# EasyEDA Pro project USB hub.eprj

# Schematic Schematic1
Board Name: Board1; Create Date: 2026-04-03; Page Name: P1; Project Name: USB hub; Schematic Name: Schematic1; Update Date: 2026-04-03; Company: EasyEDA.com; Page Size: A4; Version: V1.0
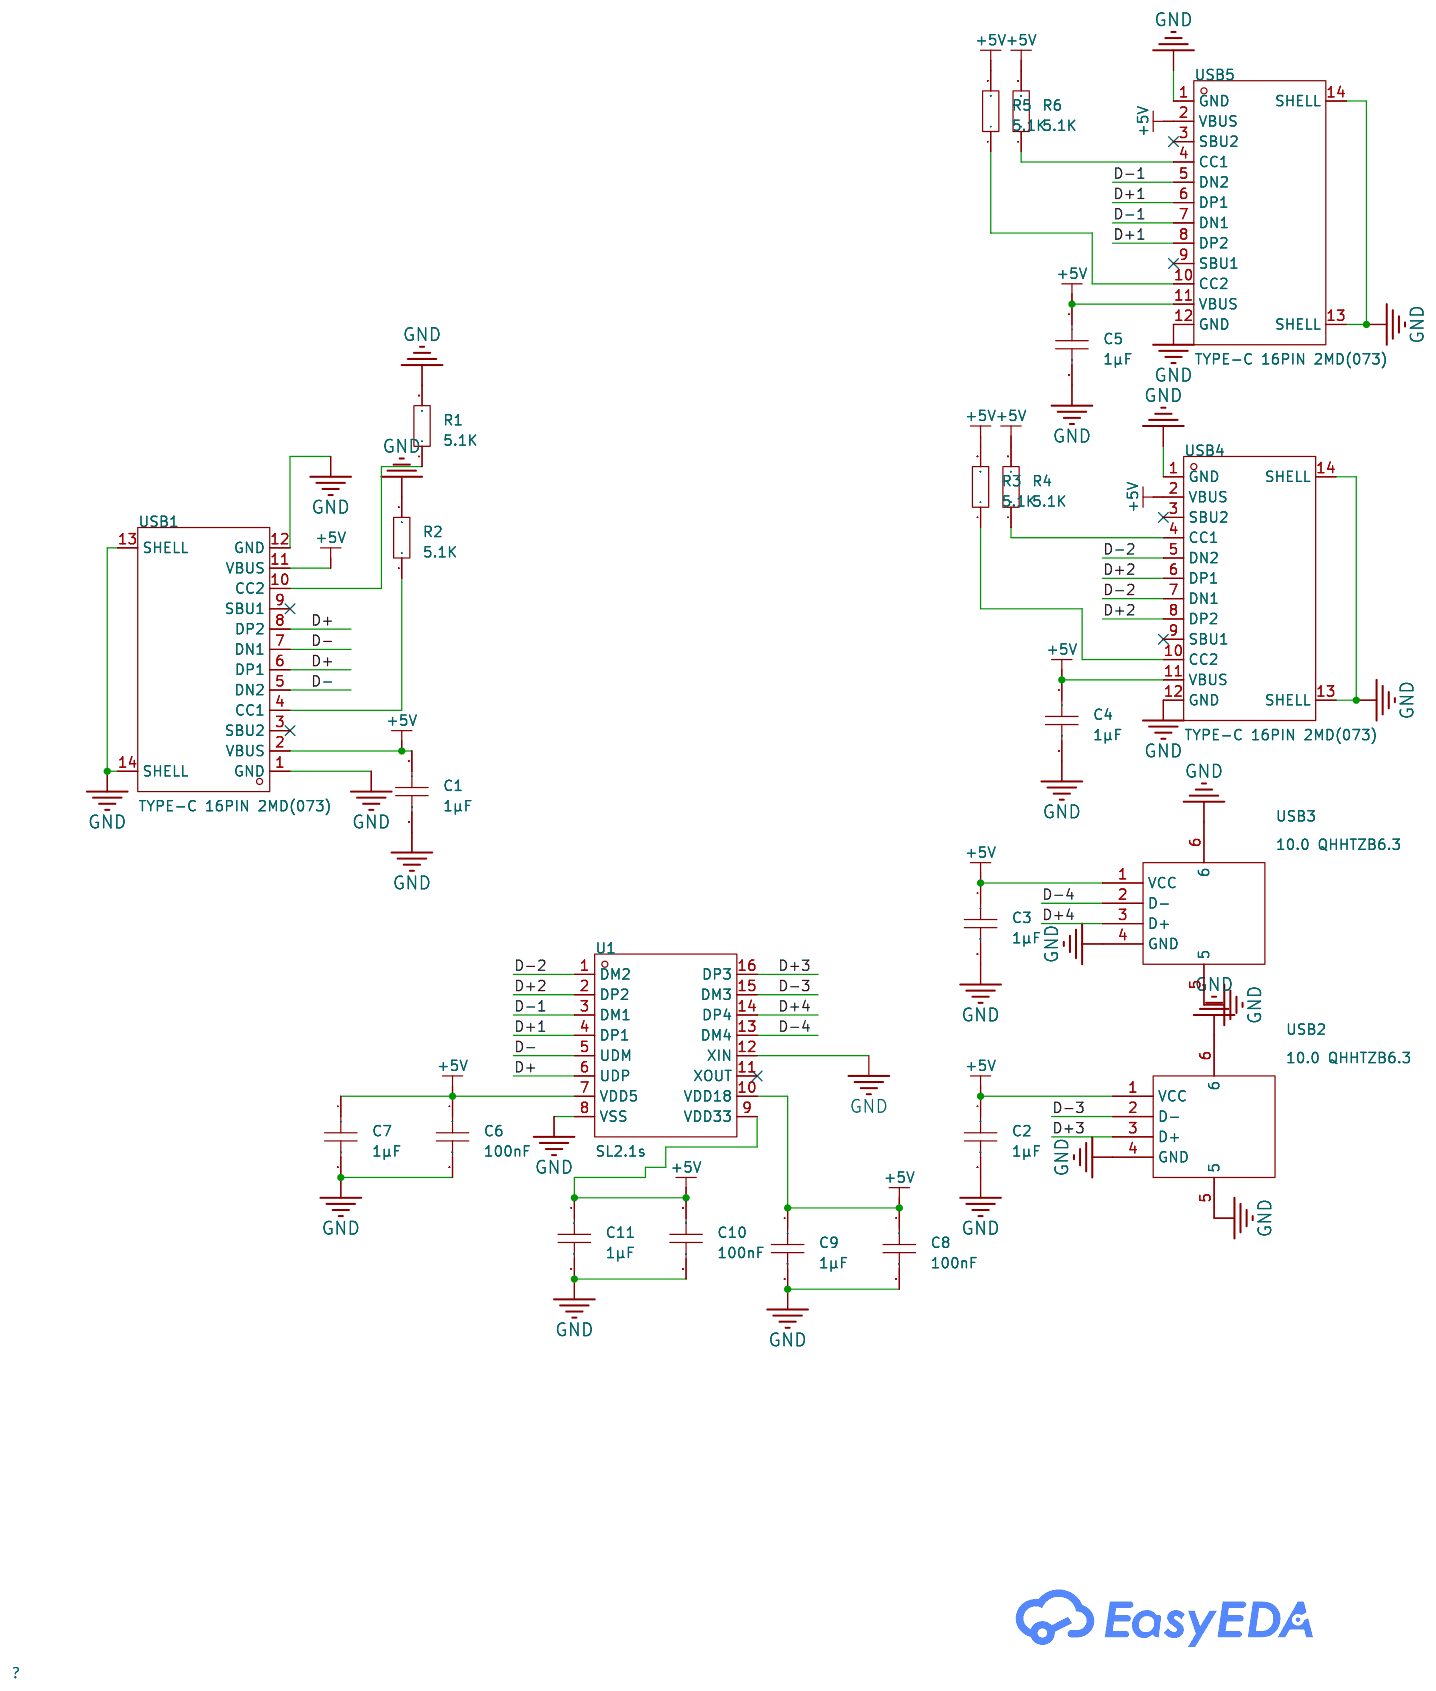
[diagram p0: schematic sheet]

## Parts
C1  1µF  [C0603]
C2  1µF  [C0603]
C3  1µF  [C0603]
C4  1µF  [C0603]
C5  1µF  [C0603]
C6  100nF  [C0603]
C7  1µF  [C0603]
C8  100nF  [C0603]
C9  1µF  [C0603]
C10  100nF  [C0603]
C11  1µF  [C0603]
R1  5.1K  [R0603]
R2  5.1K  [R0603]
R3  5.1K  [R0603]
R4  5.1K  [R0603]
R5  5.1K  [R0603]
R6  5.1K  [R0603]
U1  SL2.1s  [SSOP-16_L4.6-W2.6-P0.53-LS4.0-BL]
USB1  TYPE-C 16PIN 2MD(073)  [USB-C-SMD_TYPE-C-6PIN-2MD-073]
USB2  10.0 QHHTZB6.3  [USB-A-TH_10.0QHHTZB6.3]
USB3  10.0 QHHTZB6.3  [USB-A-TH_10.0QHHTZB6.3]
USB4  TYPE-C 16PIN 2MD(073)  [USB-C-SMD_TYPE-C-6PIN-2MD-073]
USB5  TYPE-C 16PIN 2MD(073)  [USB-C-SMD_TYPE-C-6PIN-2MD-073]

## Library data of the parts
C1-C11 = CAP_0603: Supplier Footprint: 0603
R1-R6 = Res_0603: Supplier Footprint: 0603
U1 = SL2.1s: LCSC Part Name: USB2.0 HUB控制器集成电路; Supplier Part: C2684433; Manufacturer: CoreChips(和芯润德); Supplier Footprint: SSOP-16; JLCPCB Part Class: Extended Part; Datasheet: https://item.szlcsc.com/datasheet/SL2.1s/2782346.html; Supplier: LCSC; type: Hub; USB Protocol: USB 2.0; Voltage - Supply: 4V~5.25V; Operating Temperature: 0℃~+70℃; Current - Supply: 120mA; Quiescent Supply Current: 2.5mA; Number of Channels: 4
USB1 USB4 USB5 = TYPE-C 16PIN 2MD(073): LCSC Part Name: Type-C 母 卧贴; Supplier Part: C2765186; Manufacturer: SHOU HAN(首韩); Supplier Footprint: SMD; JLCPCB Part Class: Extended Part; Datasheet: https://item.szlcsc.com/datasheet/TYPE-C%252016PIN%25202MD(073)/2901843.html; Supplier: LCSC; Connector Type: Type-C; Gender: Female; Mounting Type: Surface Mount, Right Angle; Number of Contacts: 16P; Number of Ports: 1; Current Rating-Power: 3A; Voltage Rating: 5V; Connect-Disconnect Life: 10,000 Cycles; Detection color: Black; Operating Temperature: -25℃~+85℃
USB2 USB3 = 10.0 QHHTZB6.3: LCSC Part Name: 壳长10.0mm; Supplier Part: C668591; Manufacturer: SHOU HAN(首韩); Supplier Footprint: SMD; JLCPCB Part Class: Extended Part; Datasheet: https://item.szlcsc.com/datasheet/10.0%2520QHHTZB6.3/698534.html; Supplier: LCSC; Connector Type: Type-A; Protocol Standard: USB 2.0; Gender: Female; Mounting Type: Surface Mount, Right Angle; Number of Contacts: 4P; Number of Ports: 1; Current Rating-Power: 1.5A; Voltage Rating: 30V; Connect-Disconnect Life: 5,000 times; Length: 10mm; Detection color: Black; Operating Temperature: -25℃~+85℃

## Nets
+5V: C1.1 C2.1 C3.1 C4.1 C5.1 C6.1 C7.1 C8.1 C9.1 C10.1 C11.1 R3.2 R4.2 R5.2 R6.2 U1.7(VDD5) U1.9(VDD33) U1.10(VDD18) USB1.2(VBUS) USB1.11(VBUS) USB2.1(VCC) USB3.1(VCC) USB4.2(VBUS) USB4.11(VBUS) USB5.2(VBUS) USB5.11(VBUS)
GND: C1.2 C2.2 C3.2 C4.2 C5.2 C6.2 C7.2 C8.2 C9.2 C10.2 C11.2 R1.2 R2.2 U1.8(VSS) U1.12(XIN) USB1.1(GND) USB1.12(GND) USB1.13(SHELL) USB1.14(SHELL) USB2.4(GND) USB2.5 USB2.6 USB3.4(GND) USB3.5 USB3.6 USB4.1(GND) USB4.12(GND) USB4.13(SHELL) USB4.14(SHELL) USB5.1(GND) USB5.12(GND) USB5.13(SHELL) USB5.14(SHELL)
D+: U1.6(UDP) USB1.6(DP1) USB1.8(DP2)
D+1: U1.4(DP1) USB5.6(DP1) USB5.8(DP2)
D+2: U1.2(DP2) USB4.6(DP1) USB4.8(DP2)
D+3: U1.16(DP3) USB2.3(D+)
D+4: U1.14(DP4) USB3.3(D+)
D-: U1.5(UDM) USB1.5(DN2) USB1.7(DN1)
D-1: U1.3(DM1) USB5.5(DN2) USB5.7(DN1)
D-2: U1.1(DM2) USB4.5(DN2) USB4.7(DN1)
D-3: U1.15(DM3) USB2.2(D-)
D-4: U1.13(DM4) USB3.2(D-)
$1N1717: R3.1 USB4.10(CC2)
$1N1727: R4.1 USB4.4(CC1)
$1N2183: R5.1 USB5.10(CC2)
$1N2188: R6.1 USB5.4(CC1)
Net-(R1-1): R1.1 USB1.10(CC2)
Net-(R2-1): R2.1 USB1.4(CC1)

Not connected (* = marked no-connect by the designer): U1 11(XOUT)*; USB1 3(SBU2)* 9(SBU1)*; USB4 3(SBU2)* 9(SBU1)*; USB5 3(SBU2)* 9(SBU1)*

# Board PCB2
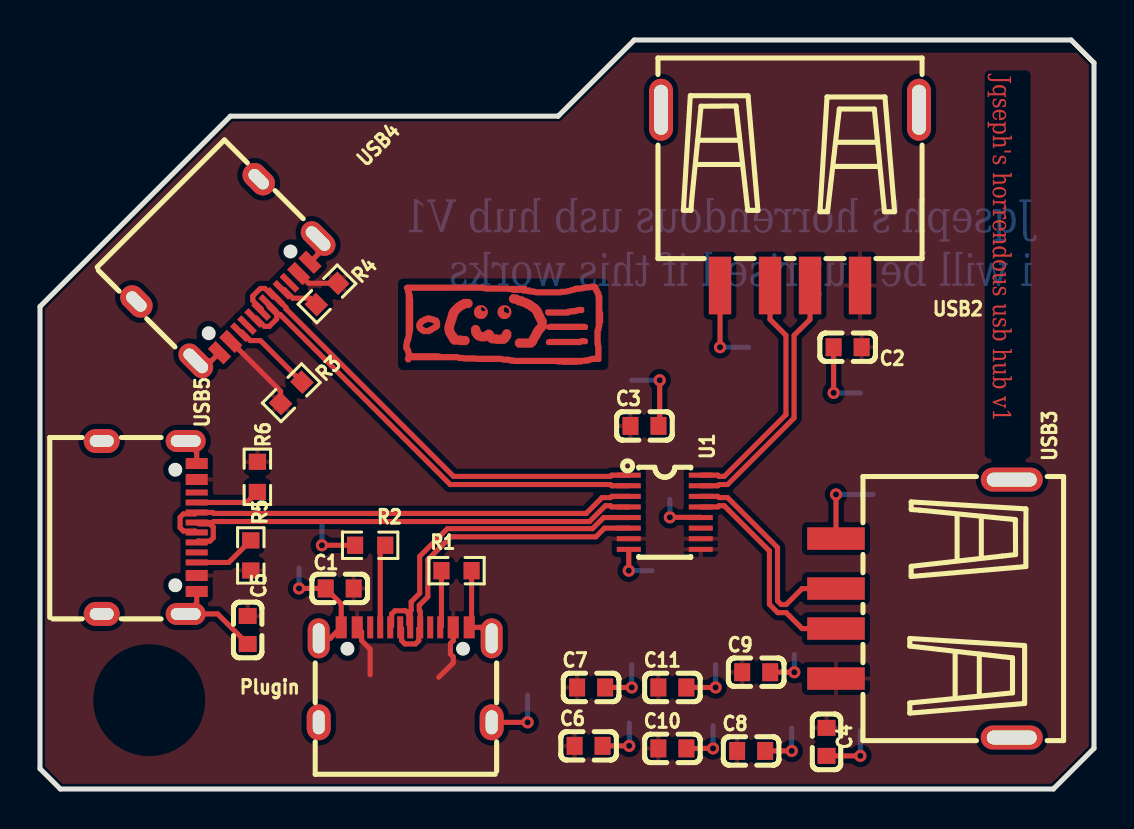
[diagram p1: board, top side]
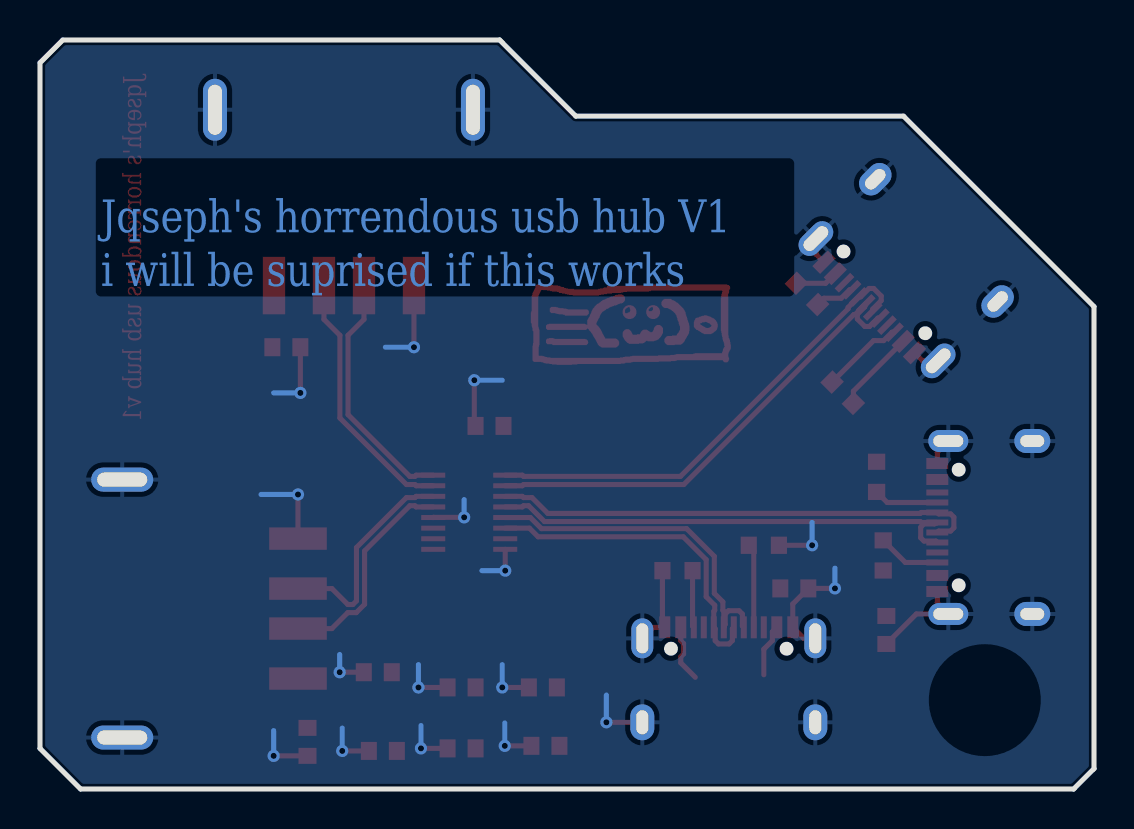
[diagram p2: board, bottom side, seen from below]

Outline 52.71 x 37.47 mm; copper layers: Top Layer, Bottom Layer. Coordinates in mm from the lower left corner of the outline.
Outline path: 0,24.13 0,1.02 1.02,0 50.67,0 52.71,2.03 52.71,36.32 51.56,37.47 29.72,37.47 25.91,33.66 9.53,33.66 0,24.13
Stack: Top Layer 0.035mm / Dielectric1 1.51mm FR4 er 4.5 / Bottom Layer 0.035mm

## Design rules (mm)
net D-2: DP3
net D+2: DP3
net D-1: DP4
net D+1: DP4
net D-: DP5
net D+: DP5
net D-4: DP2
net D+4: DP2
net D-3: DP1
net D+3: DP1
template: JLCPCB Capability(Two Layers Board)
spacing copperThickness1oz (default): track to track 0.102, other pairs 0.152 to 0.3
spacing copperThickness2oz: track to track 0.203, other pairs 0.152 to 0.3
track width copperThickness1oz (default): min 0.127, default 0.254, max 2.54
track width copperThickness2oz: min 0.203, default 0.254, max 2.54
differential pair differentialPair (default): width min 0.127, default 0.254, max 2.54; gap min 0.152, default 0.152
via viaSize (default): diameter min 0.5, default 0.61, max 10; hole min 0.3, default 0.305, max 6.3

## Placement (name value [footprint] x y rotation side)
C1  1µF  [C0603]  14.99 10.03 180 top
C2  1µF  [C0603]  40.39 22.1 180 top
C3  1µF  [C0603]  30.23 18.16 0 top
C4  1µF  [C0603]  39.33 2.36 270 top
C5  1µF  [C0603]  10.38 7.96 270 top
C6  100nF  [C0603]  27.43 2.16 0 top
C7  1µF  [C0603]  27.56 5.08 0 top
C8  100nF  [C0603]  35.56 1.91 0 top
C9  1µF  [C0603]  35.81 5.84 0 top
C10  100nF  [C0603]  31.62 2.03 0 top
C11  1µF  [C0603]  31.62 5.08 0 top
Plugin  TYPE-C 16PIN 2MD(073)  [USB-C-SMD_TYPE-C-6PIN-2MD-073]  18.26 5.71 0 top
R1  5.1K  [R0603]  20.83 10.92 0 top
R2  5.1K  [R0603]  16.51 12.19 180 top
R3  5.1K  [R0603]  12.56 19.82 225 top
R4  5.1K  [R0603]  14.35 24.77 45 top
R5  5.1K  [R0603]  10.54 11.68 270 top
R6  5.1K  [R0603]  10.87 15.61 90 top
U1  SL2.1s  [SSOP-16_L4.6-W2.6-P0.53-LS4.0-BL]  31.24 13.84 270 top
USB2  10.0 QHHTZB6.3  [USB-A-TH_10.0QHHTZB6.3]  37.5 29.58 180 top
USB3  10.0 QHHTZB6.3  [USB-A-TH_10.0QHHTZB6.3]  44.2 9.02 90 top
USB4  TYPE-C 16PIN 2MD(073)  [USB-C-SMD_TYPE-C-6PIN-2MD-073#2]  9.56 25.77 225 top
USB5  TYPE-C 16PIN 2MD(073)  [USB-C-SMD_TYPE-C-6PIN-2MD-073]  5.46 13.08 270 top

## Footprints (pads in the part's own frame, mm; a bottom-side part is the same pattern mirrored in y, then rotated)
C0603
  rect 0.8x0.9 smd: 1(-0.7,0) 2(0.7,0)
R0603
  rect 0.806x0.864 smd: 1(-0.753,0) 2(0.753,0)
SSOP-16_L4.6-W2.6-P0.53-LS4.0-BL
  rect 0.25x1.2 smd: 1(-1.855,-1.8) 2(-1.325,-1.8) 3(-0.795,-1.8) 4(-0.265,-1.8) 5(0.265,-1.8) 6(0.795,-1.8) 7(1.325,-1.8) 8(1.855,-1.8) 9(1.855,1.8) 10(1.325,1.8) 11(0.795,1.8) 12(0.265,1.8) 13(-0.265,1.8) 14(-0.795,1.8) 15(-1.325,1.8) 16(-1.855,1.8)
USB-A-TH_10.0QHHTZB6.3
  rect 1.12x2.88 smd: 1(-3.5,4.395) 2(-1,4.395) 3(1,4.395) 4(3.5,4.395)
  oval 1.2x3.1 hole 0.7x2.5: 5(-6.45,-4.395) 6(6.45,-4.395)
USB-C-SMD_TYPE-C-6PIN-2MD-073
  rect 0.55x1.1 smd: 1(-3.2,2.375) 2(-2.4,2.375) 11(2.4,2.375) 12(3.2,2.375)
  rect 0.3x1.1 smd: 3(-1.75,2.375) 4(-1.25,2.375) 5(-0.75,2.375) 6(-0.25,2.375) 7(0.25,2.375) 8(0.75,2.375) 9(1.25,2.375) 10(1.75,2.375)
  oval 1.1x2 hole 0.6x1.5: 13(-4.325,1.825) 14(4.325,1.825)
  oval 1.2x1.8 hole 0.6x1.2: 13(-4.325,-2.375) 14(4.325,-2.375)
USB-C-SMD_TYPE-C-6PIN-2MD-073#2
  rect 0.55x1.1 smd: 1(-3.2,2.375) 2(-2.4,2.375) 11(2.4,2.375) 12(3.2,2.375)
  rect 0.3x1.1 smd: 3(-1.75,2.375) 4(-1.25,2.375) 5(-0.75,2.375) 6(-0.25,2.375) 7(0.25,2.375) 8(0.75,2.375) 9(1.25,2.375) 10(1.75,2.375)
  oval 1.1x2 hole 0.6x1.5: 13(-4.325,1.825) 14(4.325,1.825)
  oval 1.2x1.8 hole 0.6x1.2: 13(-4.325,-2.375) 14(4.325,-2.375)

## Nets
+5V: C1.1 C2.1 C3.1 C4.1 C5.1 C6.1 C7.1 C8.1 C9.1 C10.1 C11.1 Plugin.2 Plugin.11 R3.2 R4.2 R5.2 R6.2 U1.7 U1.9 U1.10 USB2.1 USB3.1 USB4.2 USB4.11 USB5.2 USB5.11
GND: C1.2 C2.2 C3.2 C4.2 C5.2 C6.2 C7.2 C8.2 C9.2 C10.2 C11.2 Plugin.1 Plugin.12 Plugin.13 Plugin.14 R1.2 R2.2 U1.8 U1.12 USB2.4 USB2.5 USB2.6 USB3.4 USB3.5 USB3.6 USB4.1 USB4.12 USB4.13 USB4.14 USB5.1 USB5.12 USB5.13 USB5.14
D+: Plugin.6 Plugin.8 U1.6
D+1: U1.4 USB5.6 USB5.8
D+2: U1.2 USB4.6 USB4.8
D+3: U1.16 USB2.3
D+4: U1.14 USB3.3
D-: Plugin.5 Plugin.7 U1.5
D-1: U1.3 USB5.5 USB5.7
D-2: U1.1 USB4.5 USB4.7
D-3: U1.15 USB2.2
D-4: U1.13 USB3.2
$1N1095: Plugin.10 R1.1
$1N1104: Plugin.4 R2.1
$1N1717: R3.1 USB4.10
$1N1727: R4.1 USB4.4
$1N2183: R5.1 USB5.10
$1N2188: R6.1 USB5.4

Pads without a net: Plugin 3 9; U1 11; USB4 3 9; USB5 3 9

## Via types
v1: diameter 0.61, hole 0.305, Top Layer to Bottom Layer, 16 vias

## Routing (per net, layer and track width the routed paths; a pad name or vN(x,y) marks a point on that pad's centre or on a via; arc(x,y) is an arc through that point)
+5V: length 11.8
  Top Layer w0.254: USB4.2 13.42,25.3 R4.2 ; 19.94,5.59 20.66,6.31 20.66,6.62 20.52,6.76 20.52,7.28 20.66,7.42 Plugin.11 ; Plugin.2 16.08,7.87 16.08,7.42 16.51,7 16.51,5.72 ; 9.54,22.39 12.03,19.9 12.03,19.29
GND: length 63.4
  Top Layer w0.254: Plugin.14 22.04,8.09 Plugin.12 21.58,8.21 R1.2 ; C10.2 v1(33.66,2.03) ; Plugin.14 v1(24.38,3.34) ; USB4.12 8.57,21.42 7.79,21.42 ; U1.12 33.03,13.59 v1(31.5,13.59) ; R2.2 v1(14.1,12.19) ; Plugin.13 14.51,7.54 Plugin.1 15.06,9.26 C1.2 v1(12.95,10.03) ; C5.2 8.88,8.76 USB5.14 7.84,9.31 USB5.12 ; USB5.13 7.84,16.86 USB5.1 ; C3.2 30.99,18.22 v1(30.99,20.45) ; 13.5,26.35 13.91,26.75 USB4.13 ; 36.51,5.84 v1(37.72,5.84) ; USB3.4 v1(39.8,14.73) ; USB2.4 v1(34,22.1) ; 29.44,11.99 v1(29.44,10.92) ; C6.2 v1(29.46,2.16) ; C4.2 v1(41.02,1.66) ; C2.2 v1(39.69,19.81) ; C11.2 v1(33.78,5.08) ; C7.2 v1(29.59,5.08) ; C8.2 v1(37.59,1.91)
  Bottom Layer w0.254: v1(24.38,3.34) 24.38,4.7 ; v1(12.95,10.03) 12.95,11.05 ; v1(29.59,5.08) 29.59,6.22 ; v1(41.02,1.66) 41.02,2.92 ; v1(33.78,5.08) 33.78,6.22 ; v1(34,22.1) 35.43,22.1 ; v1(29.44,10.92) 30.61,10.92 ; v1(14.1,12.19) 14.1,13.33 ; v1(39.8,14.73) 41.66,14.73 ; v1(37.59,1.91) 37.59,3.05 ; v1(29.46,2.16) 29.46,3.3 ; v1(33.66,2.03) 33.66,3.17 ; v1(37.72,5.84) 37.72,6.73 ; v1(31.5,13.59) 31.5,14.48 ; v1(39.69,19.81) 41.02,19.81 ; v1(30.99,20.45) 29.59,20.45
D+: length 16.7
  Top Layer w0.254: Plugin.6 18.08,8.02 18.08,7.42 18.25,7.26 18.78,7.26 18.94,7.42 18.94,8.02 Plugin.8 19.01,8.89 18.97,8.94 18.97,9.19 19.39,9.62 19.39,11.47 20.54,12.62 27.8,12.62 28.23,13.05 29.44,13.05
D+1: length 24.4
  Top Layer w0.254: 29.44,14.11 28.59,14.11 28.53,14.17 28.27,14.17 27.48,13.38 8.69,13.38 8.64,13.33 USB5.6 7.86,13.31 7.93,13.31 7.98,13.26 8.5,13.26 8.66,13.1 8.66,12.57 8.5,12.4 7.91,12.4 USB5.8
D+2: length 24.2
  Top Layer w0.254: 29.44,15.17 28.59,15.17 28.53,15.23 20.51,15.23 12.01,23.73 11.94,23.73 USB4.6 11.41,24.23 11.47,24.18 11.47,24.11 11.84,23.74 11.84,23.51 11.46,23.13 11.23,23.13 10.81,23.55 USB4.8
D+3: length 12.4
  Top Layer w0.254: USB2.3 36.5,23.49 37.3,22.69 37.3,18.73 34.21,15.64 33.96,15.64 33.9,15.7 U1.16
D+4: length 10.9
  Top Layer w0.254: USB3.3 38.11,10.02 37.31,9.23 37.06,9.23 36.88,9.41 36.88,12.08 34.38,14.58 33.96,14.58 33.9,14.64 U1.14
D-: length 17.4
  Top Layer w0.254: 29.44,13.58 28.18,13.58 27.63,13.02 20.37,13.02 18.99,11.64 18.99,9.79 18.56,9.36 18.56,8.94 18.51,8.89 Plugin.7 18.49,8.11 18.49,8.18 18.44,8.23 18.44,8.75 18.28,8.92 17.75,8.92 17.58,8.75 17.58,8.16 Plugin.5
D-1: length 24.4
  Top Layer w0.254: USB5.7 7.76,12.9 7.17,12.9 7.01,13.07 7.01,13.6 7.17,13.76 7.76,13.76 USB5.5 8.64,13.83 8.69,13.78 27.31,13.78 28.1,14.58 28.53,14.58 28.59,14.64 29.44,14.64
D-2: length 23.8
  Top Layer w0.254: USB4.7 11.06,24.01 10.64,24.43 10.64,24.66 11.02,25.04 11.25,25.04 11.67,24.62 11.77,24.62 12.3,24.09 12.3,24.02 20.68,15.64 28.53,15.64 28.59,15.7 29.44,15.7
D-3: length 13
  Top Layer w0.254: 33.04,15.17 33.9,15.17 33.96,15.23 34.38,15.23 37.71,18.56 37.71,22.69 38.5,23.49 USB2.2
D-4: length 10.9
  Top Layer w0.254: USB3.2 38.11,8.02 37.31,8.82 36.89,8.82 36.47,9.24 36.47,11.91 34.21,14.17 33.96,14.17 33.9,14.11 U1.13
$1N1095: length 2.9
  Top Layer w0.254: R1.1 20.07,8.15 Plugin.10
$1N1104: length 4.2
  Top Layer w0.254: Plugin.4 17.01,11.94 R2.1
$1N1717: length 4.1
  Top Layer w0.254: R3.1 11.02,22.43 10.52,22.43 10.1,22.85 10,22.85
$1N1727: length 2
  Top Layer w0.254: USB4.4 12.22,24.97 12.64,24.55 13.5,24.55 R4.1
$1N2183: length 3.2
  Top Layer w0.254: USB5.10 9.43,11.33 R5.1
$1N2188: length 3.3
  Top Layer w0.254: USB5.4 10.34,14.33 R6.1

## Copper pours and planes (outline as drawn; the poured copper is in the pictures)
+5V on Top Layer: -0.89,36.83 53.21,36.83 53.21,-0.51 -0.89,-0.51
GND on Bottom Layer: -8.38,43.43 56.51,43.43 56.51,-4.32 -8.38,-4.32

Small or netless copper shapes (teardrops, artwork), in the pictures only: 9 on Top Layer

## Text on the board
Bottom Layer: Jqseph's horrendous usb hub V1 / i will be suprised if this works
Top Layer: Jqseph's horrendous usb hub v1
